# EAGLE schematic RS232_NPN_PNP_FTDI_PowerSel (EAGLE 7.7.0)
RS232 Adapter using NPN and PNP Transistors
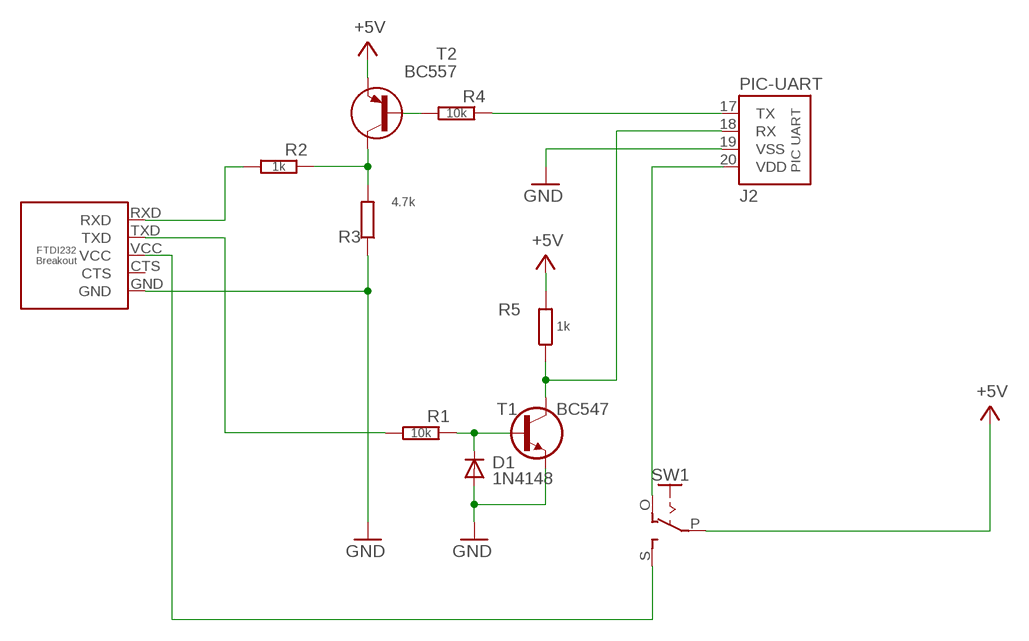
[diagram p0: schematic, sheet 1]

## Parts
D1  1N4148  1N414834-5  [DO34-5]
J1  FTDI232-BO-5P-L  [FTDI232-BO-5-L]
J2  PIC-UART  [PIC-UART]
R1  10k  R0202/5-V  [0202/5-V]
R2  1k  R0202/5  [0202/5]
R3  4.7k  R0202/5-V  [0202/5-V]
R4  10k  R0202/5  [0202/5]
R5  1k  R0202/5-V  [0202/5-V]
SW1  SL-SW-1P-2T-JPSW  [JPSW-1P2T]
T1  BC547  BC547CBE  [TO92-CBE]
T2  BC557  BC557CBE  [TO92-CBE]

## Nets
+5V: R5.2 SW1.P T2.E
GND: D1.A J1.GND J2.19(VSS) R3.1 T1.E
N$1: J2.18(RX) R5.1 T1.C
N$2: D1.C R1.1 T1.B
N$3: J1.TXD R1.2
N$4: J2.17(TX) R4.1
N$5: R4.2 T2.B
N$6: R2.1 R3.2 T2.C
N$7: J1.RXD R2.2
N$8: J1.VCC SW1.S
N$10: J2.20(VDD) SW1.O
Unconnected: J1.CTS

## Library data of the parts
D1 = d:1N4148
J1 = pinconn:FTDI232-BO-5P
J2 = pinconn:PIC-UART
R1-R5 = r:R: RESISTOR, European symbol
SW1 = sw:SL-SW-1P-2T
T1 = t:BC547
T2 = t:BC557

## Net classes
0 default: width 0.813 mm